# Altium project LF_ESP.PrjPcb
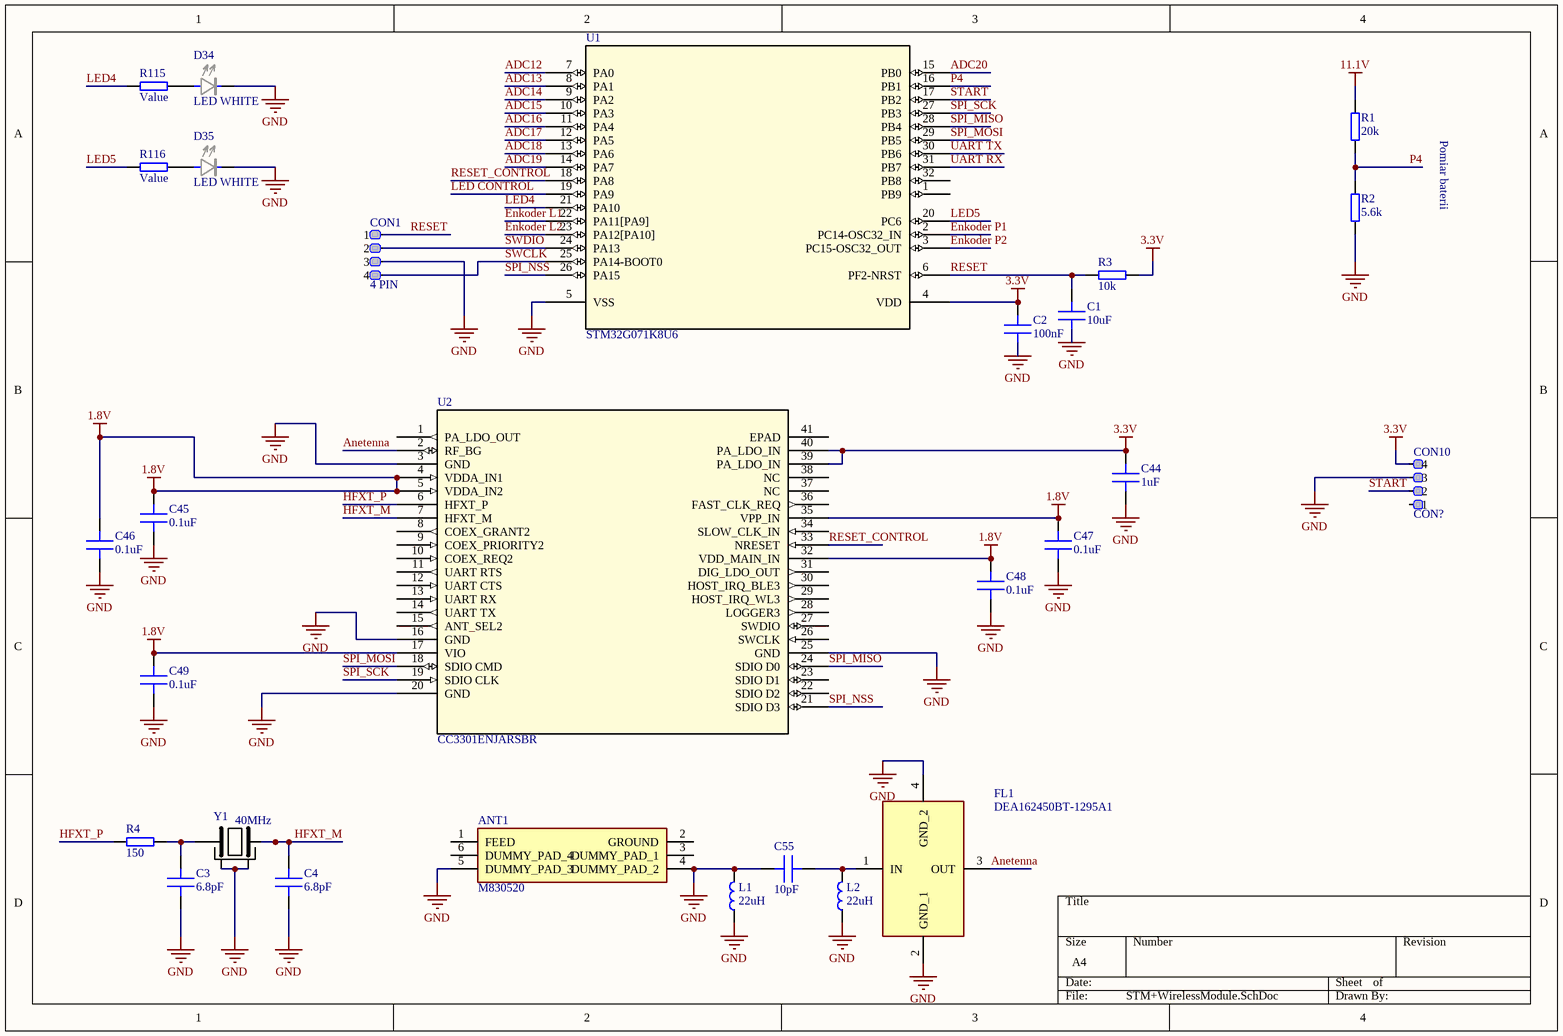
[diagram p0: STM+WirelessModule.SchDoc]
6 sheets, 246 parts. Net scope: global (net labels, ports and power ports of the same name join across sheets).
Board file: PCB1.PcbDoc
Sheets:
  STM+WirelessModule.SchDoc
  STM-LF.SchDoc
  zasilanie.SchDoc
  silniki.SchDoc
  KTIR-FRONT.SchDoc
  Ledy.SchDoc

## Sheet STM+WirelessModule.SchDoc
size A4; SheetNumber: 1; SheetTotal: 6; SPICEModelCachePTLBQKII: <root> / <DocumentId>PTLBQKII</DocumentId> / </root>

### Parts
ANT1  M830520  [M830520]
C1  10uF  [C 0603]
C2  100nF  [C 0603]
C3  6.8pF  [C 0603]
C4  6.8pF  [C 0603]
C44  1uF  [C 0603]
C45  0.1uF  [C 0603]
C46  0.1uF  [C 0603]
C47  0.1uF  [C 0603]
C48  0.1uF  [C 0603]
C49  0.1uF  [C 0603]
C55  10pF  [C 0603]
CON1  4 PIN  [BM04B-SRSS-TB]
CON10  CON?  [Goldpin 1.27mm 4PIN]
D34  LED WHITE  [LED 0603 White]
D35  LED WHITE  [LED 0603 White]
FL1  DEA162450BT-1295A1  [DEA162450BT1295A1]
L1  22uH  [L 1206]
L2  22uH  [L 1206]
R1  20k  [R 0603]
R2  5.6k  [R 0603]
R3  10k  [R 0603]
R4  150  [R 0603]
R115  Value  [R 0603]
R116  Value  [R 0603]
U1  STM32G071K8U6  [UFQFPN-32]
U2  CC3301ENJARSBR  [WQFN_JARSBR_TEX-M]
Y1  40MHz  [MCSJK7U1600123080B30]

### Nets
1.8V: C45.2 C46.2 C47.2 C48.2 C49.2 U2.4(VDDA_IN1) U2.5(VDDA_IN2) U2.17(VIO) U2.32(VDD_MAIN_IN) U2.35(VPP_IN)
3.3V: C2.2 C44.2 CON10.4 R3.1 U1.4(VDD) U2.39(PA_LDO_IN) U2.40(PA_LDO_IN)
11.1V: R1.2
GND: ANT1.4(DUMMY_PAD_2) ANT1.5(DUMMY_PAD_3) C1.1 C2.1 C3.1 C4.1 C44.1 C45.1 C46.1 C47.1 C48.1 C49.1 C55.2 CON1.3 CON10.3 D34.2 D35.2 FL1.2(GND_1) FL1.4(GND_2) L1.1 L1.2 L2.1 R2.1 U1.5(VSS) U2.3(GND) U2.16(GND) U2.20(GND) U2.25(GND) Y1.2(GND_1) Y1.4(GND_2)
ADC12: U1.7(PA0)
ADC13: U1.8(PA1)
ADC14: U1.9(PA2)
ADC15: U1.10(PA3)
ADC16: U1.11(PA4)
ADC17: U1.12(PA5)
ADC18: U1.13(PA6)
ADC19: U1.14(PA7)
ADC20: U1.15(PB0)
Anetenna: FL1.3(OUT) U2.2(RF_BG)
Enkoder L1: U1.22(PA11[PA9])
Enkoder L2: U1.23(PA12[PA10])
Enkoder P1: U1.2(PC14-OSC32_IN)
Enkoder P2: U1.3(PC15-OSC32_OUT)
HFXT_M: C4.2 U2.7(HFXT_M) Y1.3(CRYSTAL_2)
HFXT_P: R4.2 U2.6(HFXT_P)
LED4: R115.1 U1.21(PA10)
LED5: R116.1 U1.20(PC6)
LED CONTROL: U1.19(PA9)
P4: R1.1 R2.2 U1.16(PB1)
RESET: C1.2 CON1.1 R3.2 U1.6(PF2-NRST)
RESET_CONTROL: U1.18(PA8) U2.33(NRESET)
SPI_MISO: U1.28(PB4) U2.24(SDIO_D0)
SPI_MOSI: U1.29(PB5) U2.18(SDIO_CMD)
SPI_NSS: U1.26(PA15) U2.21(SDIO_D3)
SPI_SCK: U1.27(PB3) U2.19(SDIO_CLK)
START: CON10.2 U1.17(PB2)
SWCLK: CON1.4 U1.25(PA14-BOOT0)
SWDIO: CON1.2 U1.24(PA13)
UART RX: U1.31(PB7)
UART TX: U1.30(PB6)
NetC3_2: C3.2 R4.1 Y1.1(CRYSTAL_1)
NetC55_1: C55.1 FL1.1(IN) L2.2
NetD34_1: D34.1 R115.2
NetD35_1: D35.1 R116.2

Not connected (* = marked no-connect by the designer): ANT1 1(FEED) 2(GROUND) 3(DUMMY_PAD_1) 6(DUMMY_PAD_4); CON10 1; U1 1(PB9) 32(PB8); U2 1(PA_LDO_OUT) 8(COEX_GRANT2) 9(COEX_PRIORITY2) 10(COEX_REQ2) 11(UART_RTS) 12(UART_CTS) 13(UART_RX) 14(UART_TX) 15(ANT_SEL2) 22(SDIO_D2) 23(SDIO_D1) 26(SWCLK) 27(SWDIO) 28(LOGGER3) 29(HOST_IRQ_WL3) 30(HOST_IRQ_BLE3) 31(DIG_LDO_OUT) 34(SLOW_CLK_IN) 36(FAST_CLK_REQ) 37(NC) 38(NC) 41(EPAD)

### Notes on the sheet
- Pomiar baterii

### Library data of the parts
ANT1 = M830520: Antenna; Manufacturer_Name: AVX; Datasheet Link: http://datasheets.avx.com/ethertronics/AVX-E_M830520.pdf; Height: 1.4mm; Manufacturer_Part_Number: M830520; Mouser Part Number: 581-M830520; Mouser Price/Stock: https://www.mouser.co.uk/ProductDetail/AVX/M830520?qs=MLItCLRbWsxUgo9WosSjUA%3D%3D; Arrow Part Number: M830520; Arrow Price/Stock: https://www.arrow.com/en/products/m830520/avx?region=nac
C1 C2 C44-C49 C55 = Capacitor: MLCC Capacitor
C3 C4 = Capacitor: 50V 6.8pF
FL1 = DEA162450BT-1295A1: Filter; Manufacturer_Name: TDK; Datasheet Link: https://product.tdk.com/system/files/dam/doc/product/rf/rf/filter/catalog/rf_bpf_dea162450bt-1295a1_en.pdf; Height: 0.7mm; Manufacturer_Part_Number: DEA162450BT-1295A1; Mouser Part Number: 810-DEA162450BT1295A; Mouser Price/Stock: https://www.mouser.co.uk/ProductDetail/TDK/DEA162450BT-1295A1?qs=r5DSvlrkXmJWOg7G%2F4pSbg%3D%3D; Arrow Part Number: DEA162450BT-1295A1; Arrow Price/Stock: https://www.arrow.com/en/products/dea162450bt-1295a1/tdk?region=nac
L1 L2 = Inductor: General pourpouse inductor
R1-R4 R115 R116 = Resistor: General pourpouse resistor
U1 = STM32G071K8U6: No Description Available; Mfr_Name: STMicroelectronics; Copyright: Copyright (C) 2024 Ultra Librarian. All rights reserved.; Manufacturer_Part_Number: STM32G071K8U6; RefDes: RefDes; Type: DEV
U2 = CC3301ENJARSBR: No Description Available; Mfr_Name: Texas Instruments; Type: RF Transceiver ICs; RefDes: RefDes
Y1 = MCSJK-7U-16.00-12-30-80-B-30: Crystal or Oscillator; Manufacturer_Name: MULTICOMP; Datasheet Link: https://www.farnell.com/datasheets/2864166.pdf; Height: 0.8mm; Manufacturer_Part_Number: MCSJK-7U-16.00-12-30-80-B-30

## Sheet STM-LF.SchDoc
size A4; SheetNumber: 2; SheetTotal: 6
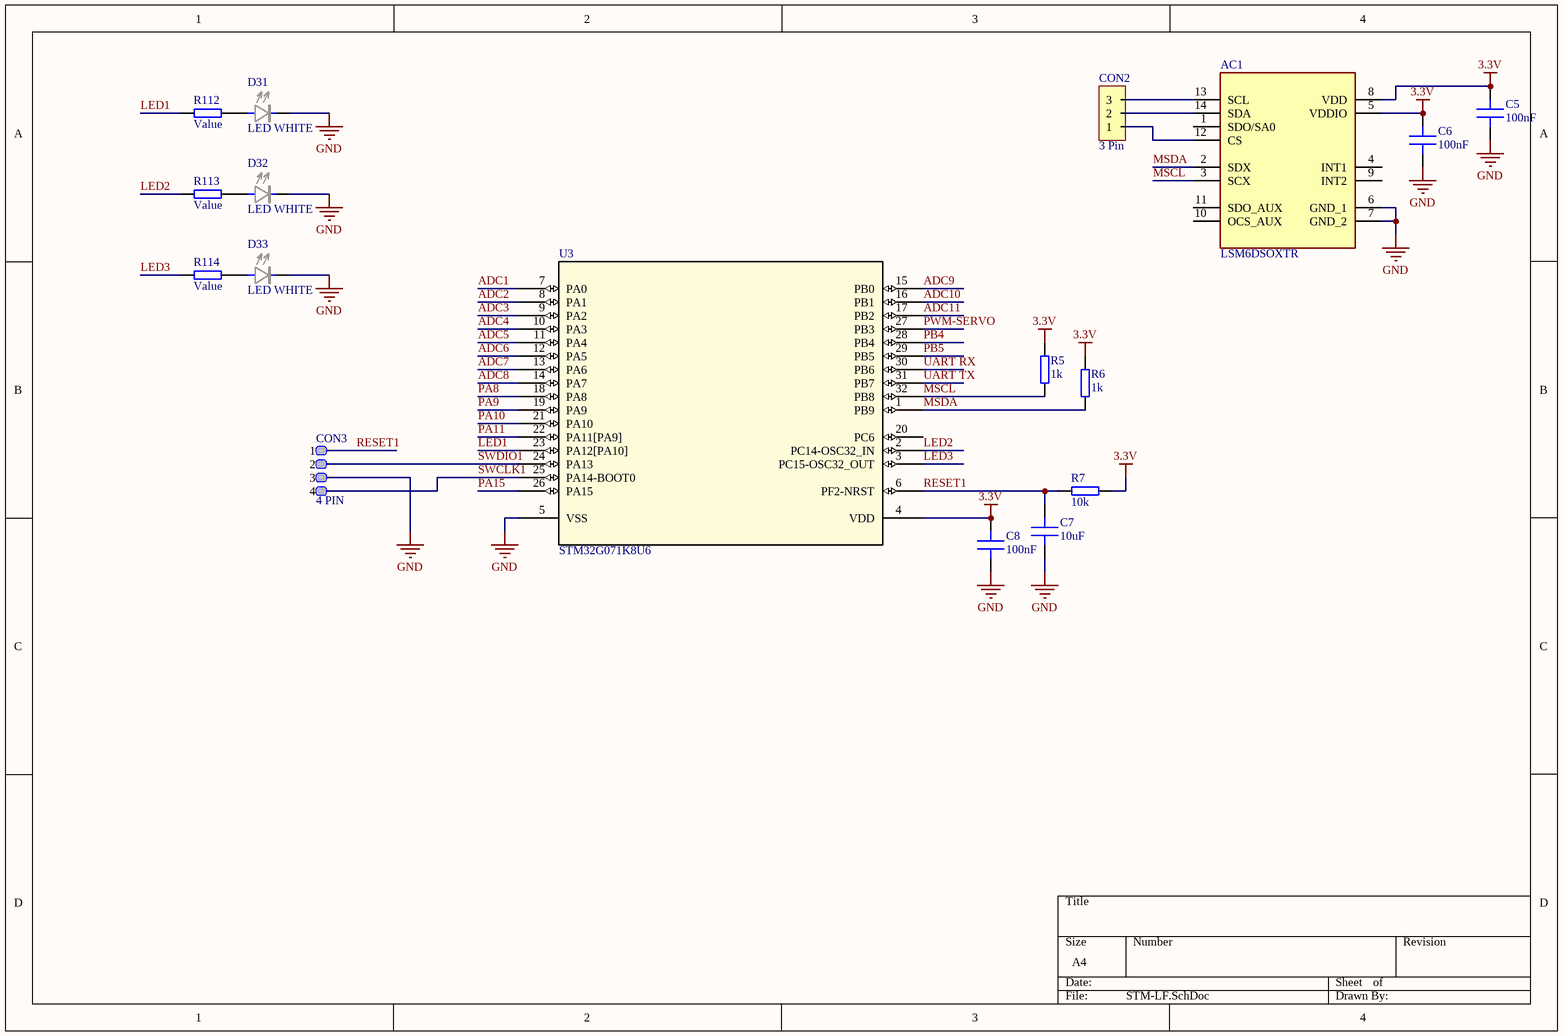
[diagram p1: STM-LF.SchDoc]

### Parts
AC1  LSM6DSOXTR  [LGA-14_1]
C5  100nF  [C 0603]
C6  100nF  [C 0603]
C7  10uF  [C 0603]
C8  100nF  [C 0603]
CON2  3 Pin  [BM03B-SRSS-TB]
CON3  4 PIN  [BM04B-SRSS-TB]
D31  LED WHITE  [LED 0603 White]
D32  LED WHITE  [LED 0603 White]
D33  LED WHITE  [LED 0603 White]
R5  1k  [R 0603]
R6  1k  [R 0603]
R7  10k  [R 0603]
R112  Value  [R 0603]
R113  Value  [R 0603]
R114  Value  [R 0603]
U3  STM32G071K8U6  [UFQFPN-32]

### Nets
3.3V: AC1.5(VDDIO) AC1.8(VDD) C5.2 C6.2 C8.2 R5.1 R6.1 R7.1 U3.4(VDD)
GND: AC1.6(GND_1) AC1.7(GND_2) C5.1 C6.1 C7.1 C8.1 CON3.3 D31.2 D32.2 D33.2 U3.5(VSS)
ADC1: U3.7(PA0)
ADC2: U3.8(PA1)
ADC3: U3.9(PA2)
ADC4: U3.10(PA3)
ADC5: U3.11(PA4)
ADC6: U3.12(PA5)
ADC7: U3.13(PA6)
ADC8: U3.14(PA7)
ADC9: U3.15(PB0)
ADC10: U3.16(PB1)
ADC11: U3.17(PB2)
LED1: R112.1 U3.23(PA12[PA10])
LED2: R113.1 U3.2(PC14-OSC32_IN)
LED3: R114.1 U3.3(PC15-OSC32_OUT)
MSCL: AC1.3(SCX) R5.2 U3.32(PB8)
MSDA: AC1.2(SDX) R6.2 U3.1(PB9)
PA8: U3.18(PA8)
PA9: U3.19(PA9)
PA10: U3.21(PA10)
PA11: U3.22(PA11[PA9])
PA15: U3.26(PA15)
PB4: U3.28(PB4)
PB5: U3.29(PB5)
PWM-SERVO: U3.27(PB3)
RESET1: C7.2 CON3.1 R7.2 U3.6(PF2-NRST)
SWCLK1: CON3.4 U3.25(PA14-BOOT0)
SWDIO1: CON3.2 U3.24(PA13)
UART RX: U3.30(PB6)
UART TX: U3.31(PB7)
NetAC1_12: AC1.12(CS) CON2.1
NetAC1_13: AC1.13(SCL) CON2.3
NetAC1_14: AC1.14(SDA) CON2.2
NetD31_1: D31.1 R112.2
NetD32_1: D32.1 R113.2
NetD33_1: D33.1 R114.2

Not connected (* = marked no-connect by the designer): AC1 1(SDO/SA0) 4(INT1) 9(INT2) 10(OCS_AUX) 11(SDO_AUX); U3 20(PC6)

### Library data of the parts
AC1 = LSM6DSOXTR: Accelerometer; Manufacturer_Name: STMicroelectronics; Datasheet Link: https://www.st.com/resource/en/datasheet/lsm6dsox.pdf; Manufacturer_Part_Number: LSM6DSOXTR; Mouser Part Number: 511-LSM6DSOXTR; Mouser Price/Stock: https://www.mouser.co.uk/ProductDetail/STMicroelectronics/LSM6DSOXTR?qs=l7cgNqFNU1i9dcjzItLpVQ%3D%3D; Arrow Part Number: LSM6DSOXTR; Arrow Price/Stock: https://www.arrow.com/en/products/lsm6dsoxtr/stmicroelectronics
C5-C8 = Capacitor: MLCC Capacitor
R5-R7 R112-R114 = Resistor: General pourpouse resistor
U3 = STM32G071K8U6: as U1 on sheet STM+WirelessModule; Copyright: Copyright (C) 2024 Ultra Librarian. All rights reserved.; Manufacturer_Part_Number: STM32G071K8U6; RefDes: RefDes; Type: DEV

## Sheet zasilanie.SchDoc
size A4; SheetNumber: 3; SheetTotal: 6
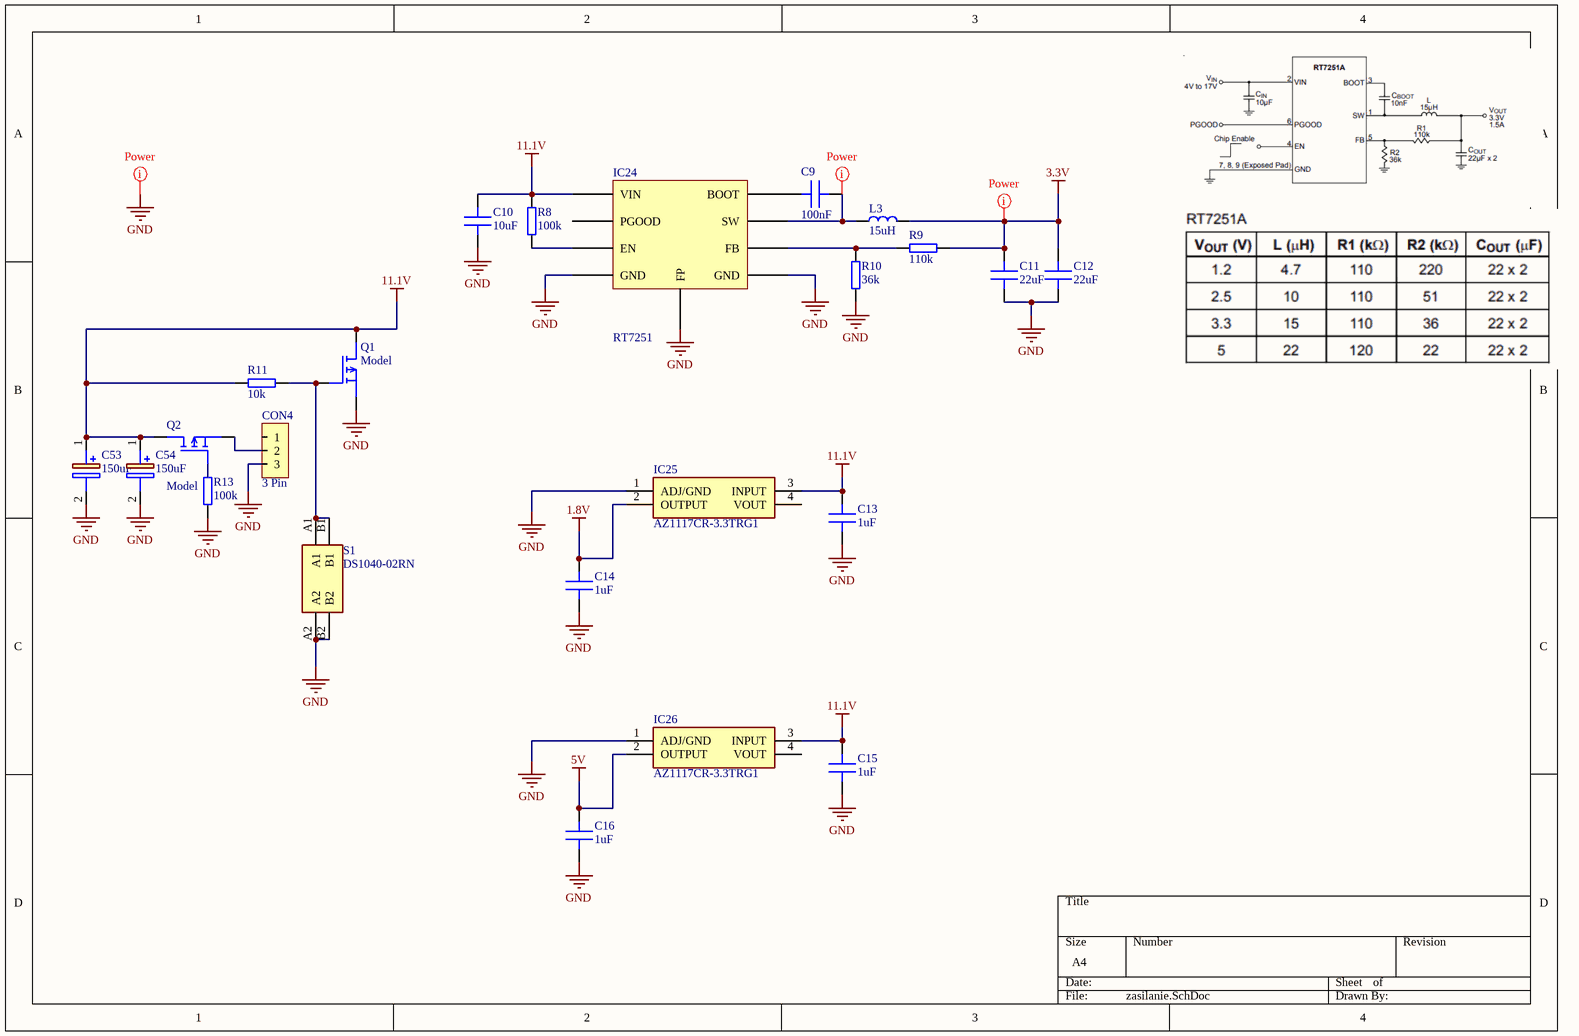
[diagram p2: zasilanie.SchDoc]

### Parts
C9  100nF  [C 0603]
C10  10uF  [C 0603]
C11  22uF  [C 0805]
C12  22uF  [C 0805]
C13  1uF  [C 0603]
C14  1uF  [C 0603]
C15  1uF  [C 0603]
C16  1uF  [C 0603]
C53  150uF  [CAPPRD250W50D655H1250]
C54  150uF  [CAPPRD250W50D655H1250]
CON4  3 Pin  [BM03B-SRSS-TB]
IC24  RT7251  [SON50P200X200X80-9N-D]
IC25  AZ1117CR-3.3TRG1  [AZ1117CR33TRG1]
IC26  AZ1117CR-3.3TRG1  [AZ1117CR33TRG1]
L3  15uH  [HPI0630]
Q1  Model  [SOT23-3]
Q2  Model  [SOT23-3]
R8  100k  [R 0603]
R9  110k  [R 0603]
R10  36k  [R 0603]
R11  10k  [R 0603]
R13  100k  [R 0603]
S1  DS1040-02RN  [DS104002RN]

### Nets
1.8V: C14.2 IC25.2(OUTPUT)
3.3V: C11.2 C12.2 L3.2 R9.1
5V: C16.2 IC26.2(OUTPUT)
11.1V: C10.2 C13.2 C15.2 C53.1(+) C54.1(+) IC24.2(VIN) IC25.3(INPUT) IC26.3(INPUT) Q1.3(D) Q2.3(D) R8.2 R11.2
GND: C10.1 C11.1 C12.1 C13.1 C14.1 C15.1 C16.1 C53.2(-) C54.2(-) CON4.3 IC24.7(GND) IC24.8(GND) IC24.9(FP) IC25.1(ADJ/GND) IC26.1(ADJ/GND) Q1.2(S) R10.2 R13.1 S1.A2 S1.B2
NetC9_1: C9.1 IC24.3(BOOT)
NetC9_2: C9.2 IC24.1(SW) L3.1
NetCON4_2: CON4.2 Q2.2(S)
NetIC24_4: IC24.4(EN) R8.1
NetIC24_5: IC24.5(FB) R9.2 R10.1
NetQ1_1: Q1.1(G) R11.1 S1.A1 S1.B1
NetQ2_1: Q2.1(G) R13.2

Not connected (* = marked no-connect by the designer): CON4 1; IC24 6(PGOOD); IC25 4(VOUT); IC26 4(VOUT)

### Layout directives
net class Power: 3.3V, GND, NetC9_2

### Notes on the sheet
- Labels drawn without touching a wire or pin: GND

### Library data of the parts
C9-C16 = Capacitor: MLCC Capacitor
C53 C54 = UVZ1H331MPD: Capacitor Polarised; Manufacturer_Name: Nichicon; Datasheet Link: https://www.nichicon.co.jp/english/products/pdfs/e-uvz.pdf; Height: 17.5mm; Manufacturer_Part_Number: UVZ1H331MPD; Mouser Part Number: 647-UVZ1H331MPD; Mouser Price/Stock: https://www.mouser.co.uk/ProductDetail/Nichicon/UVZ1H331MPD?qs=c%252BikF0N8D5kXe1Z5OktPOg%3D%3D
IC25 IC26 = AZ1117CR-3.3TRG1: Integrated Circuit; Manufacturer_Name: Diodes Inc.; Datasheet Link: https://www.diodes.com/assets/Datasheets/AZ1117C.pdf; Height: 2mm; Manufacturer_Part_Number: AZ1117CR-3.3TRG1; Mouser Part Number: 621-AZ1117CR-3.3TRG1; Mouser Price/Stock: https://www.mouser.co.uk/ProductDetail/Diodes-Incorporated/AZ1117CR-3.3TRG1?qs=FKu9oBikfSlEg7waHw2tMw%3D%3D; Arrow Part Number: AZ1117CR-3.3TRG1; Arrow Price/Stock: https://www.arrow.com/en/products/az1117cr-3.3trg1/diodes-incorporated?region=nac
L3 = Inductor: General pourpouse inductor
Q1 Q2 = P Mosfet: General Pourpouse Mosfet
R8-R11 R13 = Resistor: General pourpouse resistor
S1 = DS1040-02RN: Switch; Manufacturer_Name: Connfly; Datasheet Link: https://static.chipdip.ru/lib/974/DOC000974669.pdf; Height: 7.6mm; Manufacturer_Part_Number: DS1040-02RN

## Sheet silniki.SchDoc
size A4; SheetNumber: 4; SheetTotal: 6
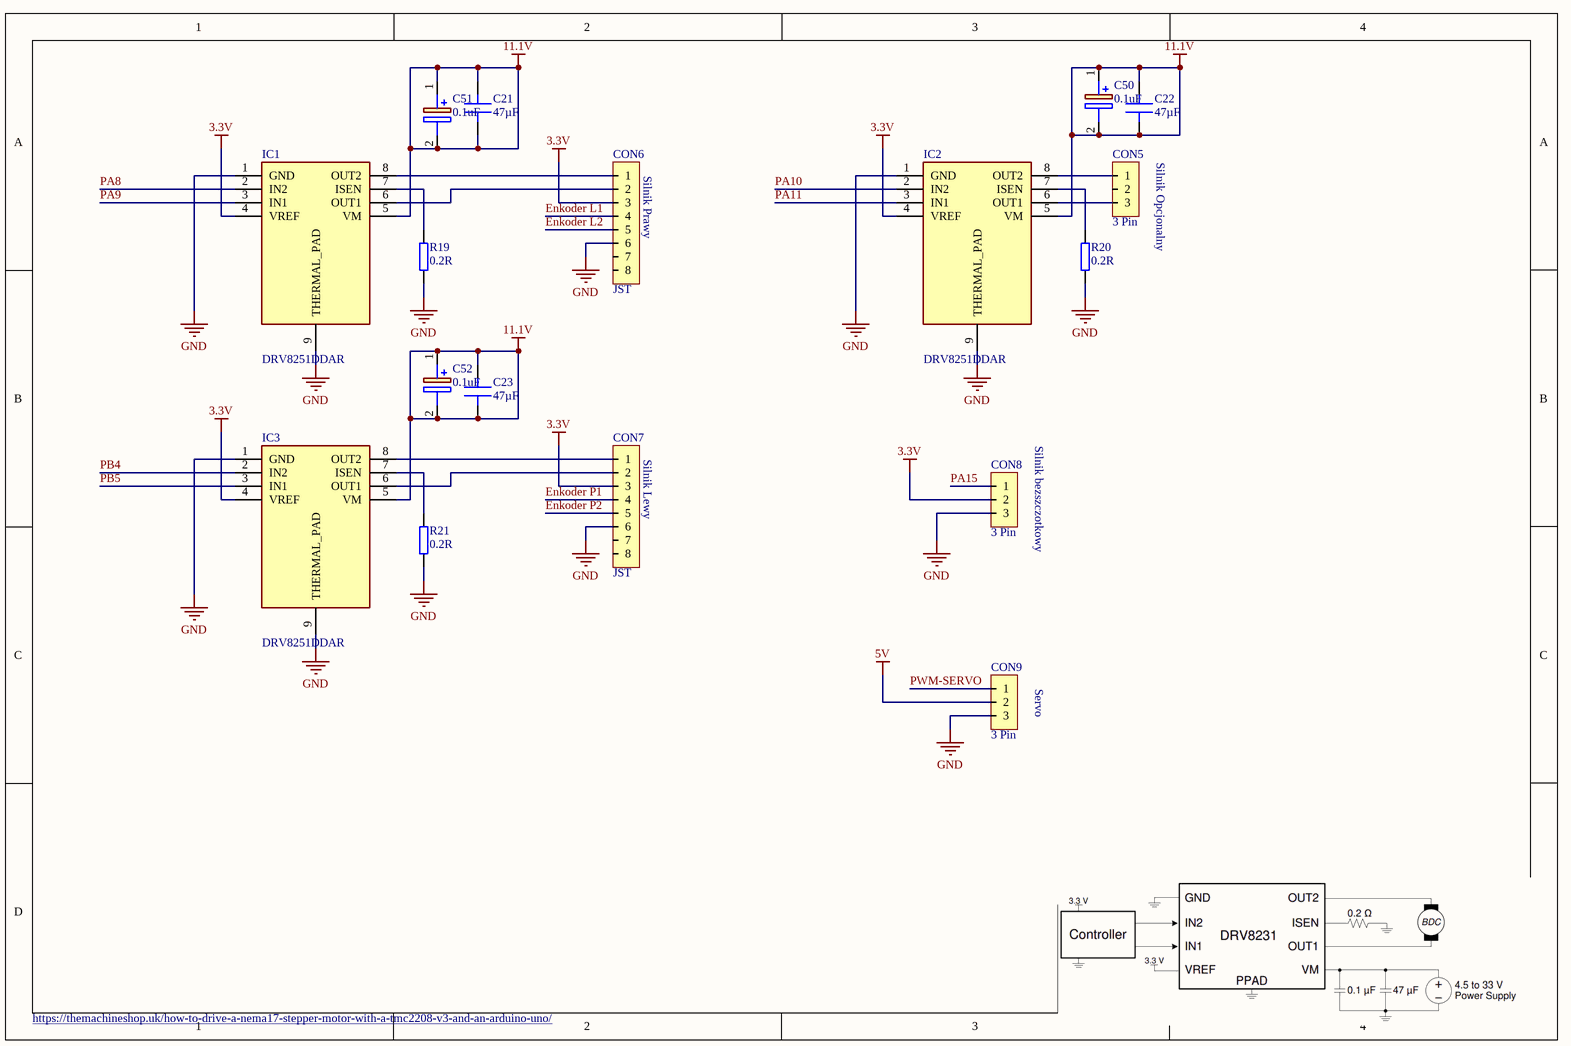
[diagram p3: silniki.SchDoc]

### Parts
C21  47µF  [C 0603]
C22  47µF  [C 0603]
C23  47µF  [C 0603]
C50  0.1uF  [CAPPRD250W50D655H1250]
C51  0.1uF  [CAPPRD250W50D655H1250]
C52  0.1uF  [CAPPRD250W50D655H1250]
CON5  3 Pin  [BM03B-SRSS-TB]
CON6  JST  [BM08B-SRSS-TB]
CON7  JST  [BM08B-SRSS-TB]
CON8  3 Pin  [BM03B-SRSS-TB]
CON9  3 Pin  [BM03B-SRSS-TB]
IC1  DRV8251DDAR  [SOIC127P600X170-9N]
IC2  DRV8251DDAR  [SOIC127P600X170-9N]
IC3  DRV8251DDAR  [SOIC127P600X170-9N]
R19  0.2R  [R 1206]
R20  0.2R  [R 1206]
R21  0.2R  [R 1206]

### Nets
3.3V: CON6.3 CON7.3 CON8.2 IC1.4(VREF) IC2.4(VREF) IC3.4(VREF)
5V: CON9.2
11.1V: C21.1 C21.2 C22.1 C22.2 C23.1 C23.2 C50.1(+) C50.2(-) C51.1(+) C51.2(-) C52.1(+) C52.2(-) IC1.5(VM) IC2.5(VM) IC3.5(VM)
GND: CON6.6 CON7.6 CON8.3 CON9.3 IC1.1(GND) IC1.9(THERMAL_PAD) IC2.1(GND) IC2.9(THERMAL_PAD) IC3.1(GND) IC3.9(THERMAL_PAD) R19.1 R20.1 R21.1
Enkoder L1: CON6.4
Enkoder L2: CON6.5
Enkoder P1: CON7.4
Enkoder P2: CON7.5
PA8: IC1.2(IN2)
PA9: IC1.3(IN1)
PA10: IC2.2(IN2)
PA11: IC2.3(IN1)
PA15: CON8.1
PB4: IC3.2(IN2)
PB5: IC3.3(IN1)
PWM-SERVO: CON9.1
NetCON5_1: CON5.1 IC2.8(OUT2)
NetCON5_3: CON5.3 IC2.6(OUT1)
NetCON6_1: CON6.1 IC1.8(OUT2)
NetCON6_2: CON6.2 IC1.6(OUT1)
NetCON7_1: CON7.1 IC3.8(OUT2)
NetCON7_2: CON7.2 IC3.6(OUT1)
NetIC1_7: IC1.7(ISEN) R19.2
NetIC2_7: IC2.7(ISEN) R20.2
NetIC3_7: IC3.7(ISEN) R21.2

Not connected (* = marked no-connect by the designer): CON5 2; CON6 7 8; CON7 7 8

### Notes on the sheet
- (near CON6) Silnik Prawy
- Silnik Opcjonalny
- (near CON7) Silnik Lewy
- (near CON8) Silnik bezszczotkowy
- (near CON9) Servo
- https://themachineshop.uk/how-to-drive-a-nema17-stepper-motor-with-a-tmc2208-v3-and-an-arduino-uno/

### Library data of the parts
C21-C23 = Capacitor: MLCC Capacitor
C50-C52 = UVZ1H331MPD: as C53 on sheet zasilanie; Datasheet Link: https://www.nichicon.co.jp/english/products/pdfs/e-uvz.pdf; Height: 17.5mm; Manufacturer_Part_Number: UVZ1H331MPD; Mouser Part Number: 647-UVZ1H331MPD; Mouser Price/Stock: https://www.mouser.co.uk/ProductDetail/Nichicon/UVZ1H331MPD?qs=c%252BikF0N8D5kXe1Z5OktPOg%3D%3D
CON6 CON7 = 8 Pin
IC1-IC3 = DRV8251DDAR: Integrated Circuit; Manufacturer_Name: Texas Instruments; Datasheet Link: https://www.arrow.com/en/products/drv8251ddar/texas-instruments?region=nac; Height: 1.7mm; Manufacturer_Part_Number: DRV8251DDAR; Mouser Part Number: 595-DRV8251DDAR; Mouser Price/Stock: https://www.mouser.co.uk/ProductDetail/Texas-Instruments/DRV8251DDAR?qs=doiCPypUmgHTzZyfapGahQ%3D%3D; Arrow Part Number: DRV8251DDAR; Arrow Price/Stock: https://www.arrow.com/en/products/drv8251ddar/texas-instruments?region=nac
R19-R21 = Resistor: General pourpouse resistor

## Sheet KTIR-FRONT.SchDoc
size A4; SheetNumber: 5; SheetTotal: 6
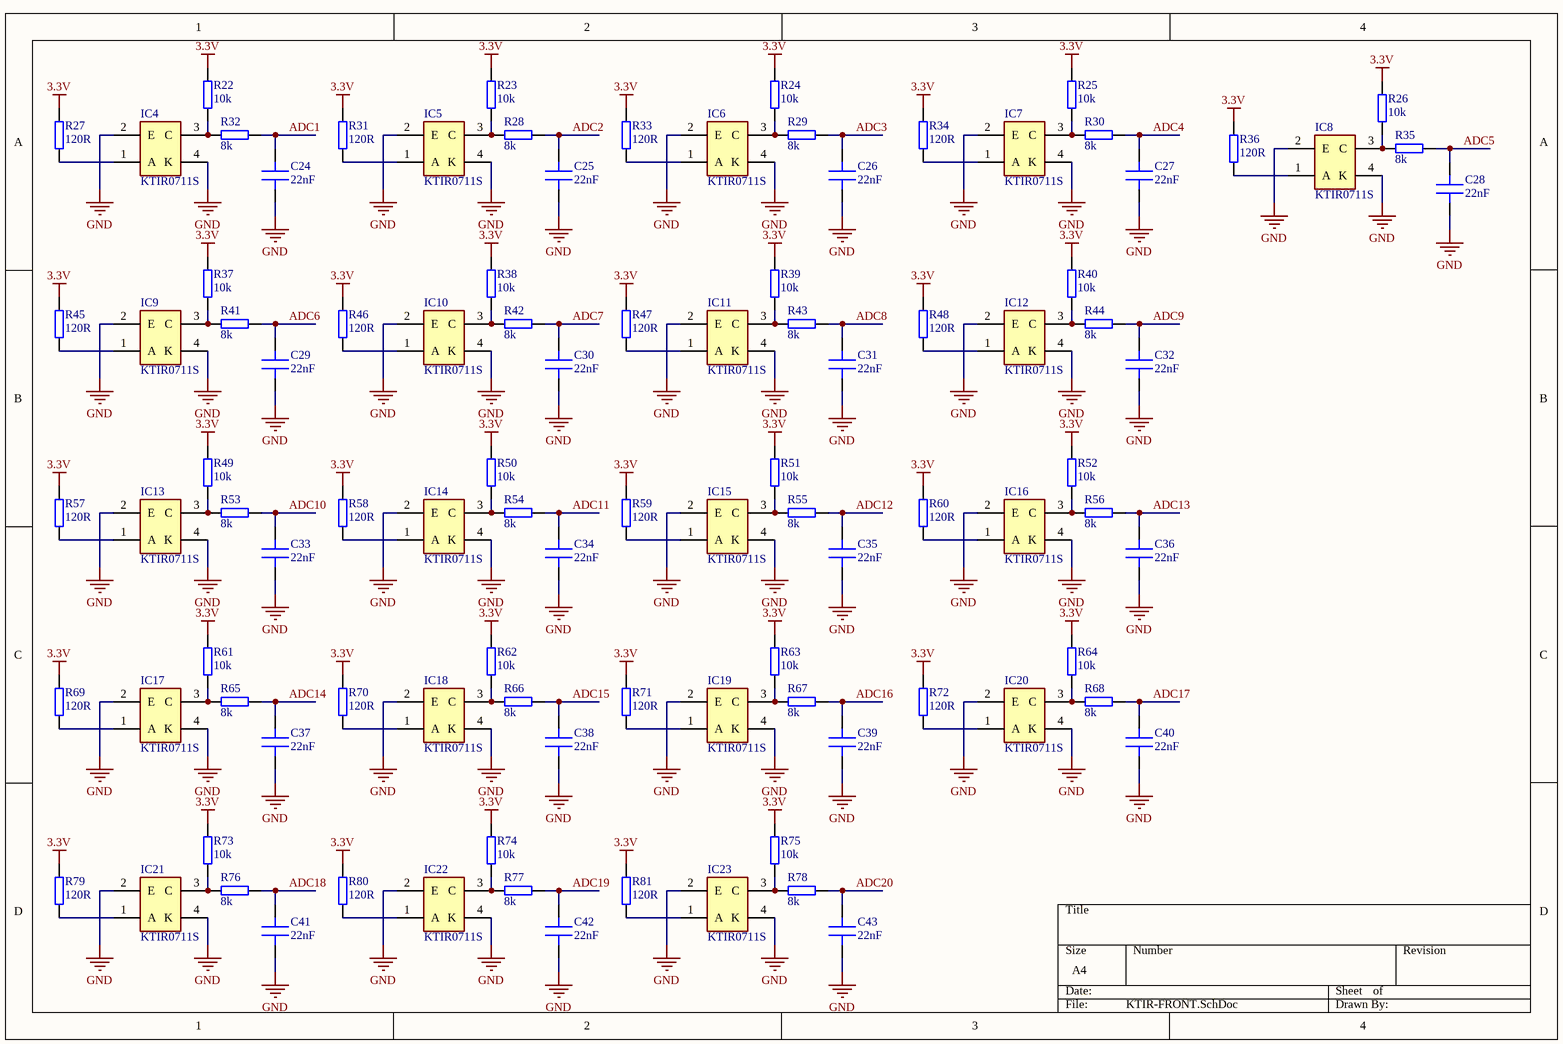
[diagram p4: KTIR-FRONT.SchDoc]

### Parts
C24  22nF  [C 0603]
C25  22nF  [C 0603]
C26  22nF  [C 0603]
C27  22nF  [C 0603]
C28  22nF  [C 0603]
C29  22nF  [C 0603]
C30  22nF  [C 0603]
C31  22nF  [C 0603]
C32  22nF  [C 0603]
C33  22nF  [C 0603]
C34  22nF  [C 0603]
C35  22nF  [C 0603]
C36  22nF  [C 0603]
C37  22nF  [C 0603]
C38  22nF  [C 0603]
C39  22nF  [C 0603]
C40  22nF  [C 0603]
C41  22nF  [C 0603]
C42  22nF  [C 0603]
C43  22nF  [C 0603]
IC4  KTIR0711S  [KTIR0711S]
IC5  KTIR0711S  [KTIR0711S]
IC6  KTIR0711S  [KTIR0711S]
IC7  KTIR0711S  [KTIR0711S]
IC8  KTIR0711S  [KTIR0711S]
IC9  KTIR0711S  [KTIR0711S]
IC10  KTIR0711S  [KTIR0711S]
IC11  KTIR0711S  [KTIR0711S]
IC12  KTIR0711S  [KTIR0711S]
IC13  KTIR0711S  [KTIR0711S]
IC14  KTIR0711S  [KTIR0711S]
IC15  KTIR0711S  [KTIR0711S]
IC16  KTIR0711S  [KTIR0711S]
IC17  KTIR0711S  [KTIR0711S]
IC18  KTIR0711S  [KTIR0711S]
IC19  KTIR0711S  [KTIR0711S]
IC20  KTIR0711S  [KTIR0711S]
IC21  KTIR0711S  [KTIR0711S]
IC22  KTIR0711S  [KTIR0711S]
IC23  KTIR0711S  [KTIR0711S]
R22  10k  [R 0603]
R23  10k  [R 0603]
R24  10k  [R 0603]
R25  10k  [R 0603]
R26  10k  [R 0603]
R27  120R  [R 0603]
R28  8k  [R 0603]
R29  8k  [R 0603]
R30  8k  [R 0603]
R31  120R  [R 0603]
R32  8k  [R 0603]
R33  120R  [R 0603]
R34  120R  [R 0603]
R35  8k  [R 0603]
R36  120R  [R 0603]
R37  10k  [R 0603]
R38  10k  [R 0603]
R39  10k  [R 0603]
R40  10k  [R 0603]
R41  8k  [R 0603]
R42  8k  [R 0603]
R43  8k  [R 0603]
R44  8k  [R 0603]
R45  120R  [R 0603]
R46  120R  [R 0603]
R47  120R  [R 0603]
R48  120R  [R 0603]
R49  10k  [R 0603]
R50  10k  [R 0603]
R51  10k  [R 0603]
R52  10k  [R 0603]
R53  8k  [R 0603]
R54  8k  [R 0603]
R55  8k  [R 0603]
R56  8k  [R 0603]
R57  120R  [R 0603]
R58  120R  [R 0603]
R59  120R  [R 0603]
R60  120R  [R 0603]
R61  10k  [R 0603]
R62  10k  [R 0603]
R63  10k  [R 0603]
R64  10k  [R 0603]
R65  8k  [R 0603]
R66  8k  [R 0603]
R67  8k  [R 0603]
R68  8k  [R 0603]
R69  120R  [R 0603]
R70  120R  [R 0603]
R71  120R  [R 0603]
R72  120R  [R 0603]
R73  10k  [R 0603]
R74  10k  [R 0603]
R75  10k  [R 0603]
R76  8k  [R 0603]
R77  8k  [R 0603]
R78  8k  [R 0603]
R79  120R  [R 0603]
R80  120R  [R 0603]
R81  120R  [R 0603]

### Nets
3.3V: R22.1 R23.1 R24.1 R25.1 R26.1 R27.1 R31.1 R33.1 R34.1 R36.1 R37.1 R38.1 R39.1 R40.1 R45.1 R46.1 R47.1 R48.1 R49.1 R50.1 R51.1 R52.1 R57.1 R58.1 R59.1 R60.1 R61.1 R62.1 R63.1 R64.1 R69.1 R70.1 R71.1 R72.1 R73.1 R74.1 R75.1 R79.1 R80.1 R81.1
GND: C24.2 C25.2 C26.2 C27.2 C28.2 C29.2 C30.2 C31.2 C32.2 C33.2 C34.2 C35.2 C36.2 C37.2 C38.2 C39.2 C40.2 C41.2 C42.2 C43.2 IC4.2(E) IC4.4(K) IC5.2(E) IC5.4(K) IC6.2(E) IC6.4(K) IC7.2(E) IC7.4(K) IC8.2(E) IC8.4(K) IC9.2(E) IC9.4(K) IC10.2(E) IC10.4(K) IC11.2(E) IC11.4(K) IC12.2(E) IC12.4(K) IC13.2(E) IC13.4(K) IC14.2(E) IC14.4(K) IC15.2(E) IC15.4(K) IC16.2(E) IC16.4(K) IC17.2(E) IC17.4(K) IC18.2(E) IC18.4(K) IC19.2(E) IC19.4(K) IC20.2(E) IC20.4(K) IC21.2(E) IC21.4(K) IC22.2(E) IC22.4(K) IC23.2(E) IC23.4(K)
ADC1: C24.1 R32.1
ADC2: C25.1 R28.1
ADC3: C26.1 R29.1
ADC4: C27.1 R30.1
ADC5: C28.1 R35.1
ADC6: C29.1 R41.1
ADC7: C30.1 R42.1
ADC8: C31.1 R43.1
ADC9: C32.1 R44.1
ADC10: C33.1 R53.1
ADC11: C34.1 R54.1
ADC12: C35.1 R55.1
ADC13: C36.1 R56.1
ADC14: C37.1 R65.1
ADC15: C38.1 R66.1
ADC16: C39.1 R67.1
ADC17: C40.1 R68.1
ADC18: C41.1 R76.1
ADC19: C42.1 R77.1
ADC20: C43.1 R78.1
NetIC4_1: IC4.1(A) R27.2
NetIC4_3: IC4.3(C) R22.2 R32.2
NetIC5_1: IC5.1(A) R31.2
NetIC5_3: IC5.3(C) R23.2 R28.2
NetIC6_1: IC6.1(A) R33.2
NetIC6_3: IC6.3(C) R24.2 R29.2
NetIC7_1: IC7.1(A) R34.2
NetIC7_3: IC7.3(C) R25.2 R30.2
NetIC8_1: IC8.1(A) R36.2
NetIC8_3: IC8.3(C) R26.2 R35.2
NetIC9_1: IC9.1(A) R45.2
NetIC9_3: IC9.3(C) R37.2 R41.2
NetIC10_1: IC10.1(A) R46.2
NetIC10_3: IC10.3(C) R38.2 R42.2
NetIC11_1: IC11.1(A) R47.2
NetIC11_3: IC11.3(C) R39.2 R43.2
NetIC12_1: IC12.1(A) R48.2
NetIC12_3: IC12.3(C) R40.2 R44.2
NetIC13_1: IC13.1(A) R57.2
NetIC13_3: IC13.3(C) R49.2 R53.2
NetIC14_1: IC14.1(A) R58.2
NetIC14_3: IC14.3(C) R50.2 R54.2
NetIC15_1: IC15.1(A) R59.2
NetIC15_3: IC15.3(C) R51.2 R55.2
NetIC16_1: IC16.1(A) R60.2
NetIC16_3: IC16.3(C) R52.2 R56.2
NetIC17_1: IC17.1(A) R69.2
NetIC17_3: IC17.3(C) R61.2 R65.2
NetIC18_1: IC18.1(A) R70.2
NetIC18_3: IC18.3(C) R62.2 R66.2
NetIC19_1: IC19.1(A) R71.2
NetIC19_3: IC19.3(C) R63.2 R67.2
NetIC20_1: IC20.1(A) R72.2
NetIC20_3: IC20.3(C) R64.2 R68.2
NetIC21_1: IC21.1(A) R79.2
NetIC21_3: IC21.3(C) R73.2 R76.2
NetIC22_1: IC22.1(A) R80.2
NetIC22_3: IC22.3(C) R74.2 R77.2
NetIC23_1: IC23.1(A) R81.2
NetIC23_3: IC23.3(C) R75.2 R78.2

### Library data of the parts
C24-C43 = Capacitor: MLCC Capacitor
IC4-IC23 = KTIR0711S: Integrated Circuit; Manufacturer_Name: Kingbright; Datasheet Link: https://componentsearchengine.com/Datasheets/2/KTIR0711S.pdf; Height: 1.75mm; Manufacturer_Part_Number: KTIR0711S; Mouser Part Number: N/A; Mouser Price/Stock: https://www.mouser.co.uk/ProductDetail/Kingbright/KTIR0711S?qs=2JU0tDl2GZ3YXiPz2j0FpQ%3D%3D
R22-R81 = Resistor: General pourpouse resistor

## Sheet Ledy.SchDoc
size A4; SheetNumber: 6; SheetTotal: 6
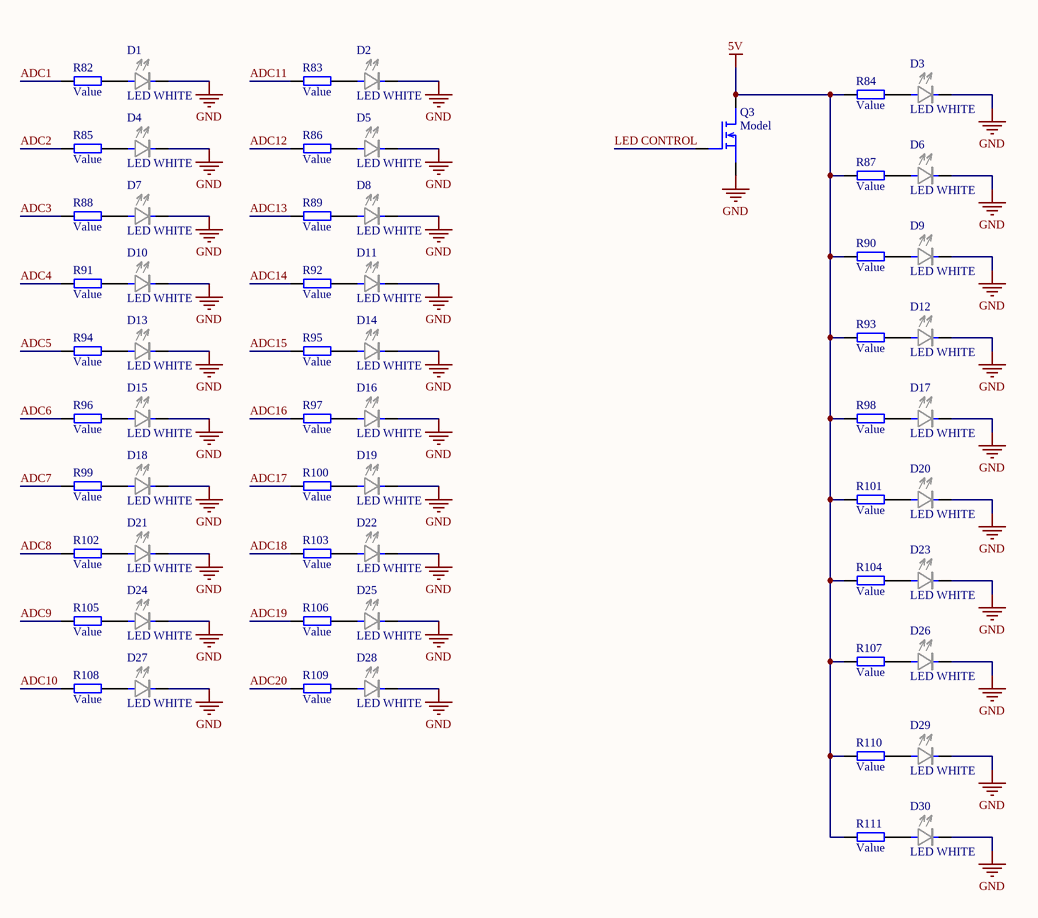
[diagram p5: Ledy.SchDoc]

### Parts
D1  LED WHITE  [LED 0603 White]
D2  LED WHITE  [LED 0603 White]
D3  LED WHITE  [LED 0603 White]
D4  LED WHITE  [LED 0603 White]
D5  LED WHITE  [LED 0603 White]
D6  LED WHITE  [LED 0603 White]
D7  LED WHITE  [LED 0603 White]
D8  LED WHITE  [LED 0603 White]
D9  LED WHITE  [LED 0603 White]
D10  LED WHITE  [LED 0603 White]
D11  LED WHITE  [LED 0603 White]
D12  LED WHITE  [LED 0603 White]
D13  LED WHITE  [LED 0603 White]
D14  LED WHITE  [LED 0603 White]
D15  LED WHITE  [LED 0603 White]
D16  LED WHITE  [LED 0603 White]
D17  LED WHITE  [LED 0603 White]
D18  LED WHITE  [LED 0603 White]
D19  LED WHITE  [LED 0603 White]
D20  LED WHITE  [LED 0603 White]
D21  LED WHITE  [LED 0603 White]
D22  LED WHITE  [LED 0603 White]
D23  LED WHITE  [LED 0603 White]
D24  LED WHITE  [LED 0603 White]
D25  LED WHITE  [LED 0603 White]
D26  LED WHITE  [LED 0603 White]
D27  LED WHITE  [LED 0603 White]
D28  LED WHITE  [LED 0603 White]
D29  LED WHITE  [LED 0603 White]
D30  LED WHITE  [LED 0603 White]
Q3  Model  [SOT323]
R82  Value  [R 0603]
R83  Value  [R 0603]
R84  Value  [R 0603]
R85  Value  [R 0603]
R86  Value  [R 0603]
R87  Value  [R 0603]
R88  Value  [R 0603]
R89  Value  [R 0603]
R90  Value  [R 0603]
R91  Value  [R 0603]
R92  Value  [R 0603]
R93  Value  [R 0603]
R94  Value  [R 0603]
R95  Value  [R 0603]
R96  Value  [R 0603]
R97  Value  [R 0603]
R98  Value  [R 0603]
R99  Value  [R 0603]
R100  Value  [R 0603]
R101  Value  [R 0603]
R102  Value  [R 0603]
R103  Value  [R 0603]
R104  Value  [R 0603]
R105  Value  [R 0603]
R106  Value  [R 0603]
R107  Value  [R 0603]
R108  Value  [R 0603]
R109  Value  [R 0603]
R110  Value  [R 0603]
R111  Value  [R 0603]

### Nets
5V: Q3.3(D) R84.1 R87.1 R90.1 R93.1 R98.1 R101.1 R104.1 R107.1 R110.1 R111.1
GND: D1.2 D2.2 D3.2 D4.2 D5.2 D6.2 D7.2 D8.2 D9.2 D10.2 D11.2 D12.2 D13.2 D14.2 D15.2 D16.2 D17.2 D18.2 D19.2 D20.2 D21.2 D22.2 D23.2 D24.2 D25.2 D26.2 D27.2 D28.2 D29.2 D30.2 Q3.2(S)
ADC1: R82.1
ADC2: R85.1
ADC3: R88.1
ADC4: R91.1
ADC5: R94.1
ADC6: R96.1
ADC7: R99.1
ADC8: R102.1
ADC9: R105.1
ADC10: R108.1
ADC11: R83.1
ADC12: R86.1
ADC13: R89.1
ADC14: R92.1
ADC15: R95.1
ADC16: R97.1
ADC17: R100.1
ADC18: R103.1
ADC19: R106.1
ADC20: R109.1
LED CONTROL: Q3.1(G)
NetD1_1: D1.1 R82.2
NetD2_1: D2.1 R83.2
NetD3_1: D3.1 R84.2
NetD4_1: D4.1 R85.2
NetD5_1: D5.1 R86.2
NetD6_1: D6.1 R87.2
NetD7_1: D7.1 R88.2
NetD8_1: D8.1 R89.2
NetD9_1: D9.1 R90.2
NetD10_1: D10.1 R91.2
NetD11_1: D11.1 R92.2
NetD12_1: D12.1 R93.2
NetD13_1: D13.1 R94.2
NetD14_1: D14.1 R95.2
NetD15_1: D15.1 R96.2
NetD16_1: D16.1 R97.2
NetD17_1: D17.1 R98.2
NetD18_1: D18.1 R99.2
NetD19_1: D19.1 R100.2
NetD20_1: D20.1 R101.2
NetD21_1: D21.1 R102.2
NetD22_1: D22.1 R103.2
NetD23_1: D23.1 R104.2
NetD24_1: D24.1 R105.2
NetD25_1: D25.1 R106.2
NetD26_1: D26.1 R107.2
NetD27_1: D27.1 R108.2
NetD28_1: D28.1 R109.2
NetD29_1: D29.1 R110.2
NetD30_1: D30.1 R111.2

### Library data of the parts
Q3 = N Mosfet: General Pourpouse Mosfet
R82-R111 = Resistor: General pourpouse resistor

## Nets that join several sheets
1.8V: STM+WirelessModule (10 pins), zasilanie (C14.2 IC25.2)
3.3V: STM+WirelessModule (7 pins), STM-LF (9 pins), zasilanie (C11.2 C12.2 L3.2 R9.1), silniki (6 pins), KTIR-FRONT (40 pins)
5V: zasilanie (C16.2 IC26.2), silniki (CON9.2), Ledy (11 pins)
11.1V: STM+WirelessModule (R1.2), zasilanie (12 pins), silniki (15 pins)
GND: STM+WirelessModule (30 pins), STM-LF (11 pins), zasilanie (20 pins), silniki (13 pins), KTIR-FRONT (60 pins), Ledy (31 pins)
ADC1: STM-LF (U3.7), KTIR-FRONT (C24.1 R32.1), Ledy (R82.1)
ADC2: STM-LF (U3.8), KTIR-FRONT (C25.1 R28.1), Ledy (R85.1)
ADC3: STM-LF (U3.9), KTIR-FRONT (C26.1 R29.1), Ledy (R88.1)
ADC4: STM-LF (U3.10), KTIR-FRONT (C27.1 R30.1), Ledy (R91.1)
ADC5: STM-LF (U3.11), KTIR-FRONT (C28.1 R35.1), Ledy (R94.1)
ADC6: STM-LF (U3.12), KTIR-FRONT (C29.1 R41.1), Ledy (R96.1)
ADC7: STM-LF (U3.13), KTIR-FRONT (C30.1 R42.1), Ledy (R99.1)
ADC8: STM-LF (U3.14), KTIR-FRONT (C31.1 R43.1), Ledy (R102.1)
ADC9: STM-LF (U3.15), KTIR-FRONT (C32.1 R44.1), Ledy (R105.1)
ADC10: STM-LF (U3.16), KTIR-FRONT (C33.1 R53.1), Ledy (R108.1)
ADC11: STM-LF (U3.17), KTIR-FRONT (C34.1 R54.1), Ledy (R83.1)
ADC12: STM+WirelessModule (U1.7), KTIR-FRONT (C35.1 R55.1), Ledy (R86.1)
ADC13: STM+WirelessModule (U1.8), KTIR-FRONT (C36.1 R56.1), Ledy (R89.1)
ADC14: STM+WirelessModule (U1.9), KTIR-FRONT (C37.1 R65.1), Ledy (R92.1)
ADC15: STM+WirelessModule (U1.10), KTIR-FRONT (C38.1 R66.1), Ledy (R95.1)
ADC16: STM+WirelessModule (U1.11), KTIR-FRONT (C39.1 R67.1), Ledy (R97.1)
ADC17: STM+WirelessModule (U1.12), KTIR-FRONT (C40.1 R68.1), Ledy (R100.1)
ADC18: STM+WirelessModule (U1.13), KTIR-FRONT (C41.1 R76.1), Ledy (R103.1)
ADC19: STM+WirelessModule (U1.14), KTIR-FRONT (C42.1 R77.1), Ledy (R106.1)
ADC20: STM+WirelessModule (U1.15), KTIR-FRONT (C43.1 R78.1), Ledy (R109.1)
Enkoder L1: STM+WirelessModule (U1.22), silniki (CON6.4)
Enkoder L2: STM+WirelessModule (U1.23), silniki (CON6.5)
Enkoder P1: STM+WirelessModule (U1.2), silniki (CON7.4)
Enkoder P2: STM+WirelessModule (U1.3), silniki (CON7.5)
LED CONTROL: STM+WirelessModule (U1.19), Ledy (Q3.1)
PA8: STM-LF (U3.18), silniki (IC1.2)
PA9: STM-LF (U3.19), silniki (IC1.3)
PA10: STM-LF (U3.21), silniki (IC2.2)
PA11: STM-LF (U3.22), silniki (IC2.3)
PA15: STM-LF (U3.26), silniki (CON8.1)
PB4: STM-LF (U3.28), silniki (IC3.2)
PB5: STM-LF (U3.29), silniki (IC3.3)
PWM-SERVO: STM-LF (U3.27), silniki (CON9.1)
UART RX: STM+WirelessModule (U1.31), STM-LF (U3.30)
UART TX: STM+WirelessModule (U1.30), STM-LF (U3.31)